# Altium schematic sheet circuit-On-Off+loudspeaker.SchDoc
size A; SheetNumber: 4; SheetTotal: 5
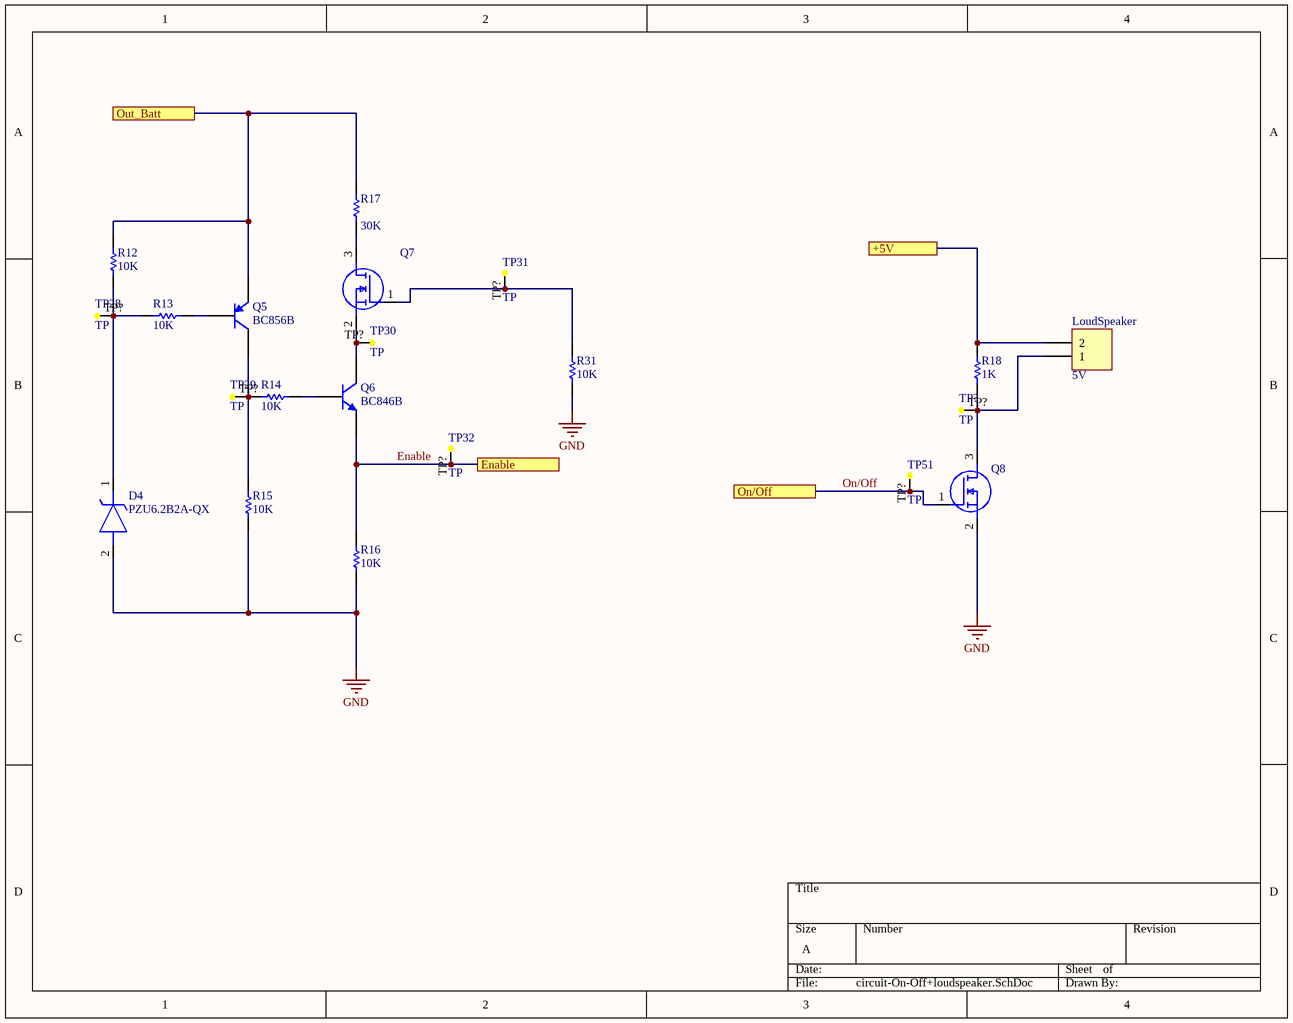
[diagram p0: circuit-On-Off+loudspeaker.SchDoc]

## Parts
D4  PZU6.2B2A-QX  [PZU62B2AQX]
LoudSpeaker  5V  [TB002V50002BE]
Q5  BC856B  [SOT95P230X110-3N]
Q6  BC846B  [SOT95P230X110-3N]
Q7  BSS138BK-215  [SOT95P230X110-3N]  (value not drawn)
Q8  BSS138BK-215  [SOT95P230X110-3N]  (value not drawn)
R12  value 10K  [RESC1608X55N]  (hidden comment: MCR03..PFX1002)
R13  value 10K  [RESC1608X55N]  (hidden comment: MCR03..PFX1002)
R14  value 10K  [RESC1608X55N]  (hidden comment: MCR03..PFX1002)
R15  value 10K  [RESC1608X55N]  (hidden comment: MCR03..PFX1002)
R16  value 10K  [RESC1608X55N]  (hidden comment: MCR03..PFX1002)
R17  value 30K  [ERJ2RKD1004X]  (hidden comment: 8909013012)
R18  value 1K  [ERJP06D1000V]  (hidden comment: MCR03..PFX1002)
R31  value 10K  [RESC1608X55N]  (hidden comment: MCR03..PFX1002)
TP28  TP  [Test_Point0.5x0.5]
TP29  TP  [Test_Point0.5x0.5]
TP30  TP  [Test_Point0.5x0.5]
TP31  TP  [Test_Point0.5x0.5]
TP32  TP  [Test_Point0.5x0.5]
TP51  TP  [Test_Point0.5x0.5]
TP?  TP  [Test_Point0.5x0.5]

## Ports
+5V, Enable, On/Off, Out_Batt

## Nets
GND: D4.2(A) Q8.2(S) R15.2 R16.2 R31.2
+5V: LoudSpeaker.2 R18.1 ; port +5V
Enable: Q6.2(E) R16.1 TP32.TP?(TP) ; port Enable
On/Off: Q8.1(G) TP51.TP?(TP) ; port On/Off
Out_Batt: Q5.2(E) R12.1 R17.2 ; port Out_Batt
NetD4_1: D4.1(K) R12.2 R13.1 TP28.TP?(TP)
NetLoudSpeaker_1: LoudSpeaker.1 Q8.3(D) R18.2 TP?.TP?(TP)
NetQ5_1: Q5.1(B) R13.2
NetQ5_3: Q5.3(C) R14.1 R15.1 TP29.TP?(TP)
NetQ6_1: Q6.1(B) R14.2
NetQ6_3: Q6.3(C) Q7.2(S) TP30.TP?(TP)
NetQ7_1: Q7.1(G) R31.1 TP31.TP?(TP)
NetQ7_3: Q7.3(D) R17.1

## Library data of the parts
D4 = PZU6.2B2A-QX: Zener Diode; Manufacturer_Name: Nexperia; Datasheet Link: https://assets.nexperia.com/documents/data-sheet/PZUXBA-Q_SER.pdf; Height: 1.1mm; Manufacturer_Part_Number: PZU6.2B2A-QX
LoudSpeaker = Header 2: Header, 2-Pin; LatestRevisionDate: 17-Jul-2002; LatestRevisionNote: Re-released for DXP Platform.; Publisher: Altium Limited
Q5 = PNP: PNP Bipolar Transistor; Published: 8-Jun-2000; LatestRevisionDate: 29-May-2009; LatestRevisionNote: IPC-7351 Footprint Added.; PackageVersion: Aug-1999; PackageReference: SOT-23B; Publisher: Altium Limited; PackageDescription: 3-Pin SOT-23 Package 0.95 mm Pitch, 2.4 mm Lead Span
Q6 = NPN: NPN Bipolar Transistor; Published: 8-Jun-2000; LatestRevisionDate: 17-Jul-2002; LatestRevisionNote: Re-released for DXP Platform.; PackageReference: TO-226-AA; Publisher: Altium Limited; PackageDescription: TO, Flat Index; 3 In-Line, Axial Leads; Body Dia. 4.8mm; Leads 0.55 x 0.51 mm (max); Code_JEDEC: TO-226-AA
Q7 Q8 = BSS138BK-215: MOSFET (N-Channel); Manufacturer_Name: Nexperia; Datasheet Link: https://assets.nexperia.com/documents/data-sheet/BSS138BK.pdf; Height: 1.1mm; Manufacturer_Part_Number: BSS138BK-215
R12-R18 R31 = Res1: Resistor; Published: 8-Jun-2000; LatestRevisionDate: 17-Jul-2002; LatestRevisionNote: Re-released for DXP Platform.; PackageReference: AXIAL-0.3; Publisher: Altium Limited; PackageDescription: Axial Device, Thru-Hole; 2 Leads; 0.3 in Pin Spacing
TP28-TP32 TP51 TP? = TEst_Point_0.5x0.5